# EAGLE design mbgw_teensy (EAGLE 8.1.0)
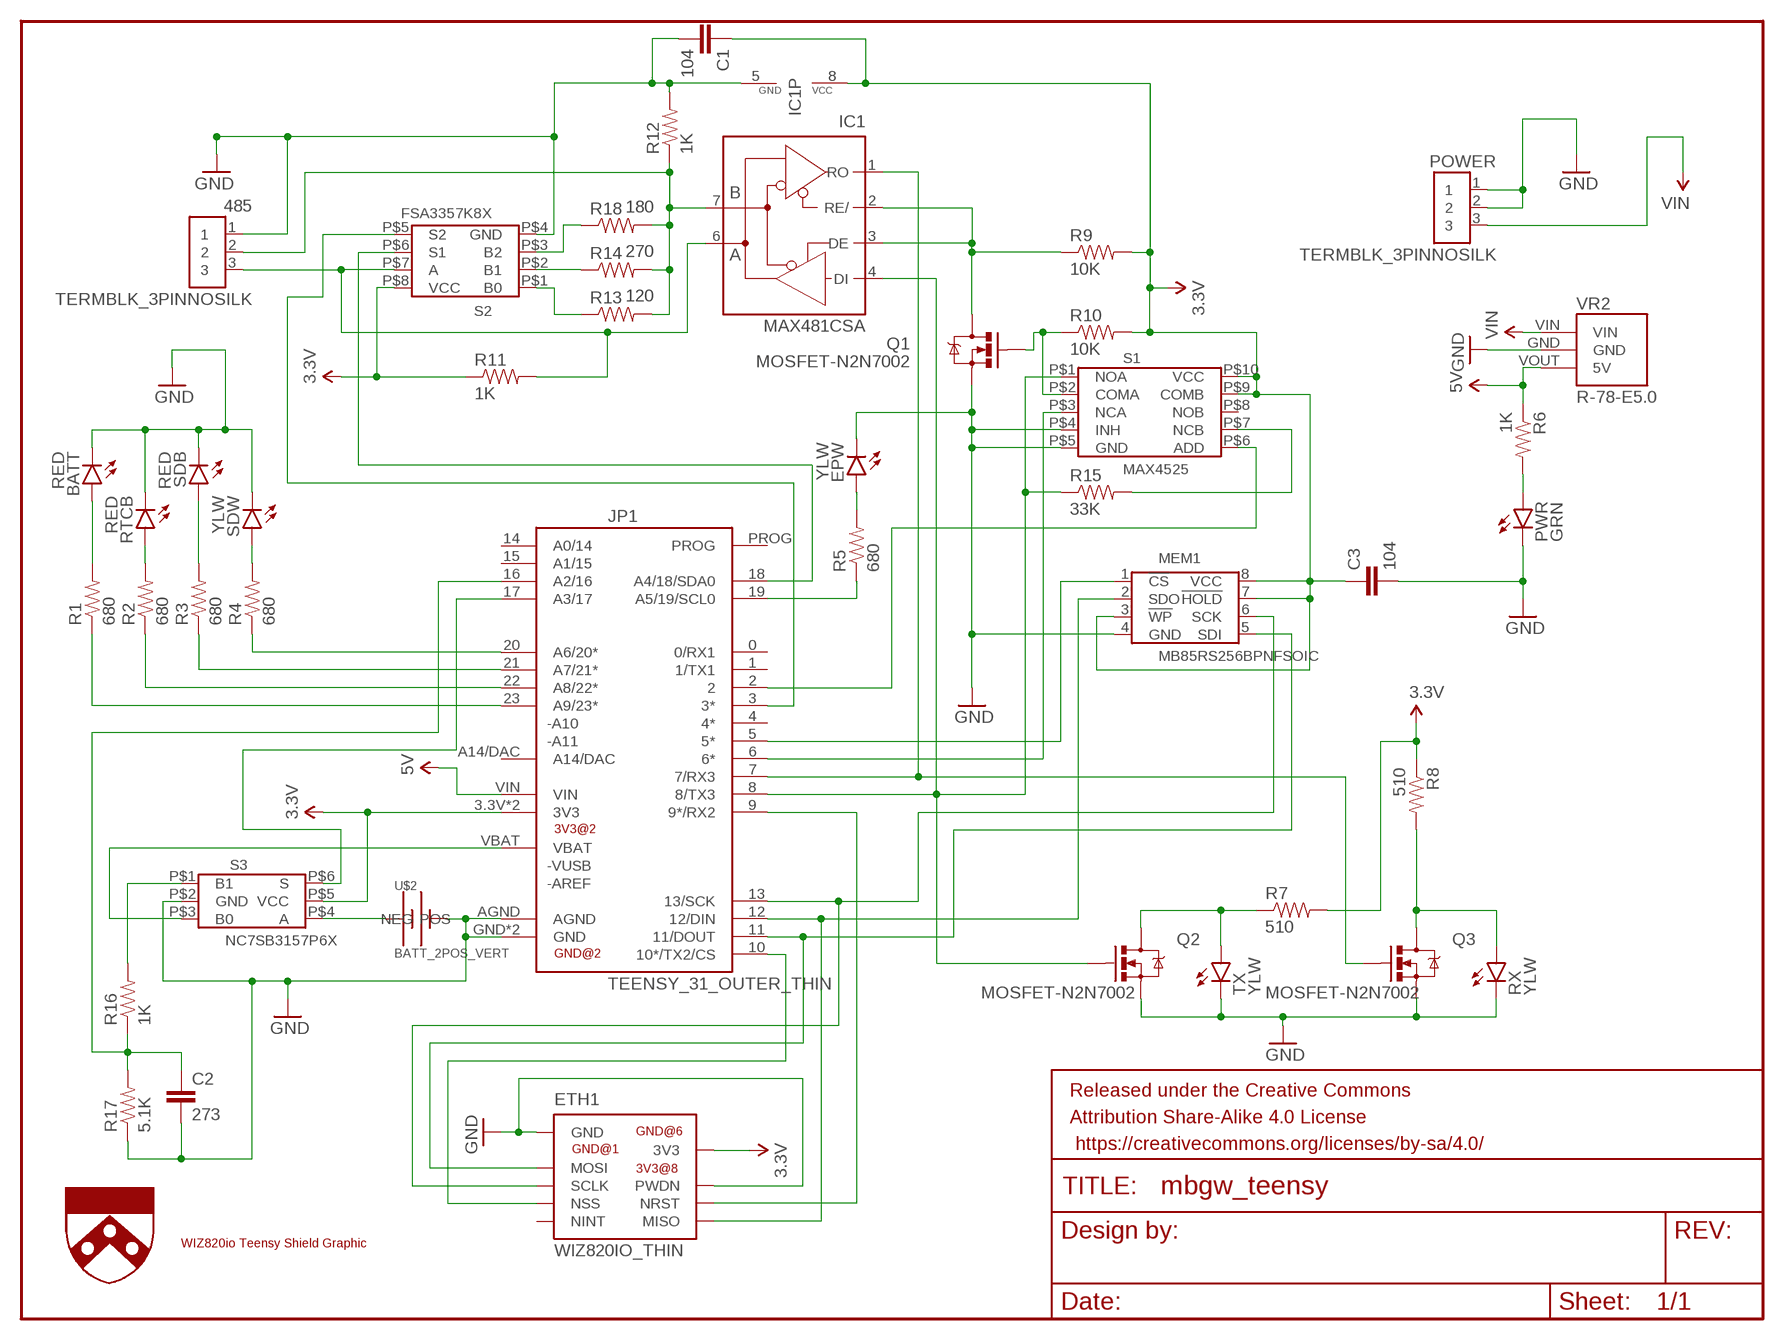
[diagram p0: schematic, sheet 1]

## Parts
485  TERMBLK_3PINNOSILK  [TERMBLK_3PIN_90_NOSILK]
BATT  RED  LED0603  [LED-0603]
C1  104  CAP0603-CAP  [0603-CAP]
C2  273  CAP0603-CAP  [0603-CAP]
C3  104  CAP0603-CAP  [0603-CAP]
EPW  YLW  LED0603  [LED-0603]
ETH1  WIZ820IO_THIN  [WIZ820IO_THIN]
FRAME1  FRAME-LETTERNO_PACKAGE  [DUMMY]
IC1  MAX481CSA  [SO08]
JP1  TEENSY_31_OUTER_THIN  [TEENSY-3.1_OUTER_THIN]
MEM1  MB85RS256BPNFSOIC  [SO08]
POWER  TERMBLK_3PINNOSILK  [TERMBLK_3PIN_90_NOSILK]
PWR  GRN  LED0603  [LED-0603]
Q1  MOSFET-N2N7002  [SOT23-3]
Q2  MOSFET-N2N7002  [SOT23-3]
Q3  MOSFET-N2N7002  [SOT23-3]
R1  680  RESISTOR0603  [0603-RES]
R2  680  RESISTOR0603  [0603-RES]
R3  680  RESISTOR0603  [0603-RES]
R4  680  RESISTOR0603  [0603-RES]
R5  680  RESISTOR0603  [0603-RES]
R6  1K  RESISTOR0603  [0603-RES]
R7  510  RESISTOR0603  [0603-RES]
R8  510  RESISTOR0603  [0603-RES]
R9  10K  RESISTOR0603  [0603-RES]
R10  10K  RESISTOR0603  [0603-RES]
R11  1K  RESISTOR0603  [0603-RES]
R12  1K  RESISTOR0603  [0603-RES]
R13  120  RESISTOR0603  [0603-RES]
R14  270  RESISTOR0603  [0603-RES]
R15  33K  RESISTOR0603  [0603-RES]
R16  1K  RESISTOR0603  [0603-RES]
R17  5.1K  RESISTOR0603  [0603-RES]
R18  180  RESISTOR0603  [0603-RES]
RTCB  RED  LED0603  [LED-0603]
RX  YLW  LED0603  [LED-0603]
S1  MAX4525  [3MM_10PIN]
S2  FSA3357K8X  [2.3MM_8PIN]
S3  NC7SB3157P6X  [1.25MM_6PIN]
SDB  RED  LED0603  [LED-0603]
SDW  YLW  LED0603  [LED-0603]
TX  YLW  LED0603  [LED-0603]
U$1  WIZ820_SHLD_OVRLY  [WIZ820_SHLD_OVERLAY]
U$2  BATT_2POS_VERT  [BATTCONN_20MM_VERT]
U$4  UPENN_SHIELD_.3_SILK  [UPENN_SHIELD_3_SILK]
VR2  R-78-E5.0  [R-78-EXX]

## Nets
3.3V: C1.1 C3.1 ETH1.3V3@7(3V3) ETH1.3V3@8(3V3) IC1.8(VCC) JP1.3.3V(3V3) JP1.3V(3V3) MEM1.3(!WP!) MEM1.7(!HOLD!) MEM1.8(VCC) R7.2 R8.1 R9.2 R10.2 R11.1 S1.P$9(COMB) S1.P$10(VCC) S2.P$8(VCC) S3.P$5(VCC)
5V: JP1.VIN R6.1 VR2.VOUT(5V)
GND: 485.1 BATT.C C1.2 C2.2 C3.2 EPW.C ETH1.GND@0(GND) ETH1.GND@1(GND) ETH1.GND@6(GND) ETH1.PWDN IC1.5(GND) JP1.AGND JP1.GND JP1.GND1(GND) MEM1.4(GND) POWER.1 POWER.2 PWR.C Q1.2(S) Q2.2(S) Q3.2(S) R12.2 R17.1 RTCB.C RX.C S1.P$4(INH) S1.P$5(GND) S2.P$4(GND) S3.P$2(GND) SDB.C SDW.C TX.C U$2.NEG VR2.GND
N$1: R15.2 S1.P$7(NCB)
N$2: JP1.6(6*) S1.P$3(NCA)
N$3: S3.P$4(A) U$2.POS@1(POS) U$2.POS@2(POS)
N$4: JP1.19(A5/19/SCL0) R5.1
N$5: ETH1.NSS JP1.10(10*/TX2/CS)
N$6: ETH1.MOSI JP1.11(11/DOUT) MEM1.5(SDI)
N$7: ETH1.MISO JP1.12(12/DIN) MEM1.2(SDO)
N$8: ETH1.SCLK JP1.13(13/SCK) MEM1.6(SCK)
N$9: JP1.23(A9/23*) R1.1
N$10: ETH1.NRST JP1.9(9*/RX2)
N$11: EPW.A R5.2
N$12: R13.1 S2.P$1(B0)
N$13: 485.2 IC1.7(B) R12.1 R13.2 R14.2 R18.2
N$14: PWR.A R6.2
N$15: JP1.18(A4/18/SDA0) S2.P$6(S1)
N$16: IC1.1(RO) JP1.7(7/RX3) Q3.1(G)
N$17: IC1.4(DI) JP1.8(8/TX3) Q2.1(G) R15.1 S1.P$1(NOA)
N$18: BATT.A R1.2
N$19: R3.2 SDB.A
N$20: R2.2 RTCB.A
N$21: R4.2 SDW.A
N$22: JP1.22(A8/22*) R2.1
N$23: JP1.21(A7/21*) R3.1
N$24: JP1.20(A6/20*) R4.1
N$25: 485.3 IC1.6(A) R11.2 S2.P$7(A)
N$26: Q1.1(G) R10.1 S1.P$2(COMA)
N$27: IC1.2(RE/) IC1.3(DE) Q1.3(D) R9.1
N$28: Q3.3(D) R8.2 RX.A
N$29: Q2.3(D) R7.1 TX.A
N$30: R14.1 S2.P$2(B1)
N$31: JP1.3(3*) S2.P$5(S2)
N$32: JP1.2 S1.P$6(ADD)
N$33: JP1.VBAT S3.P$3(B0)
N$34: R18.1 S2.P$3(B2)
N$35: C2.1 JP1.16(A2/16) R16.1 R17.2
N$36: JP1.5(5*) MEM1.1(!CS!)
N$37: R16.2 S3.P$1(B1)
N$38: JP1.17(A3/17) S3.P$6(S)
VIN: POWER.3 VR2.VIN
Unconnected: ETH1.NINT JP1.0(0/RX1) JP1.1(1/TX1) JP1.4(4*) JP1.14(A0/14) JP1.15(A1/15) JP1.A14/DAC JP1.PROG S1.P$8(NOB)

## Library data of the parts
485 POWER = UPenn:TERMBLK_3PIN
BATT EPW PWR RTCB RX SDB SDW TX = SparkFun-LED:LED: LEDs Standard schematic elements and footprints for 5mm, 3mm, 1206, and 0603 sized LEDs. 5mm - Spark Fun Electronics SKU : COM-00529 (and others)
C1-C3 = SparkFun-Capacitors:CAP: Capacitor Standard 0603 ceramic capacitor, and 0.1" leaded capacitor.
ETH1 = UPenn:WIZ820IO
FRAME1 = SparkFun-Aesthetics:FRAME-LETTER: Schematic Frame Standard 8.5x11 US Letter frame; DESIGNER: Nobody; VERSION: v01
IC1 = maxim:MAX481CSA: RS485 TRANSEIVER; MF: MAXIM; MPN: MAX481CSA; OC_FARNELL: unknown; OC_NEWARK: 90C3817
JP1 = UPenn:TEENSY_31_OUTER
MEM1 = UPenn:MB85RS256BPNF
Q1-Q3 = UPenn:MOSFET-N
R1-R18 = SparkFun-Resistors:RESISTOR: Resistor Basic schematic elements and footprints for 0603, 1206, and PTH resistors.
S1 = UPenn:MAX4525: DPDT analog switch
S2 = UPenn:FSA3357K8X: SPTT analog switch
S3 = UPenn:NC7SB3157P6X: SPDT analog switch, B0 is NC
U$1 = UPenn:WIZ820_SHLD_OVRLY
U$2 = UPenn:BATT_2POS
U$4 = UPenn:UPENN_SHIELD
VR2 = UPenn:R-78-E5.0

## Board
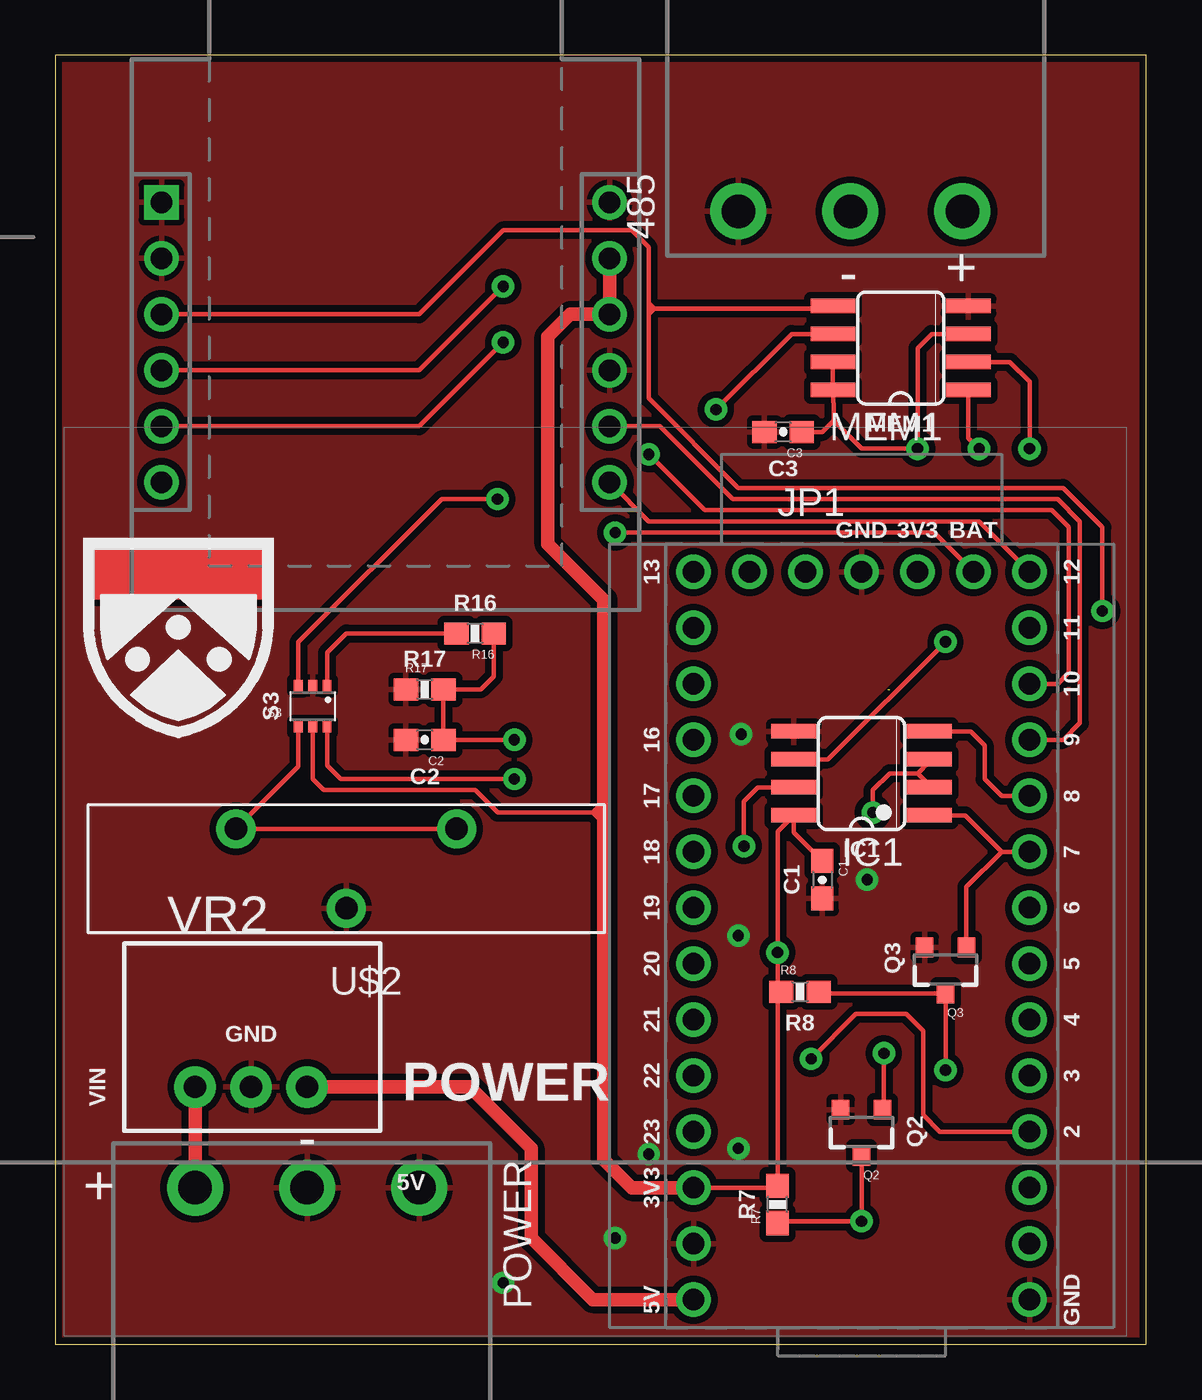
[diagram p1: board, top side]
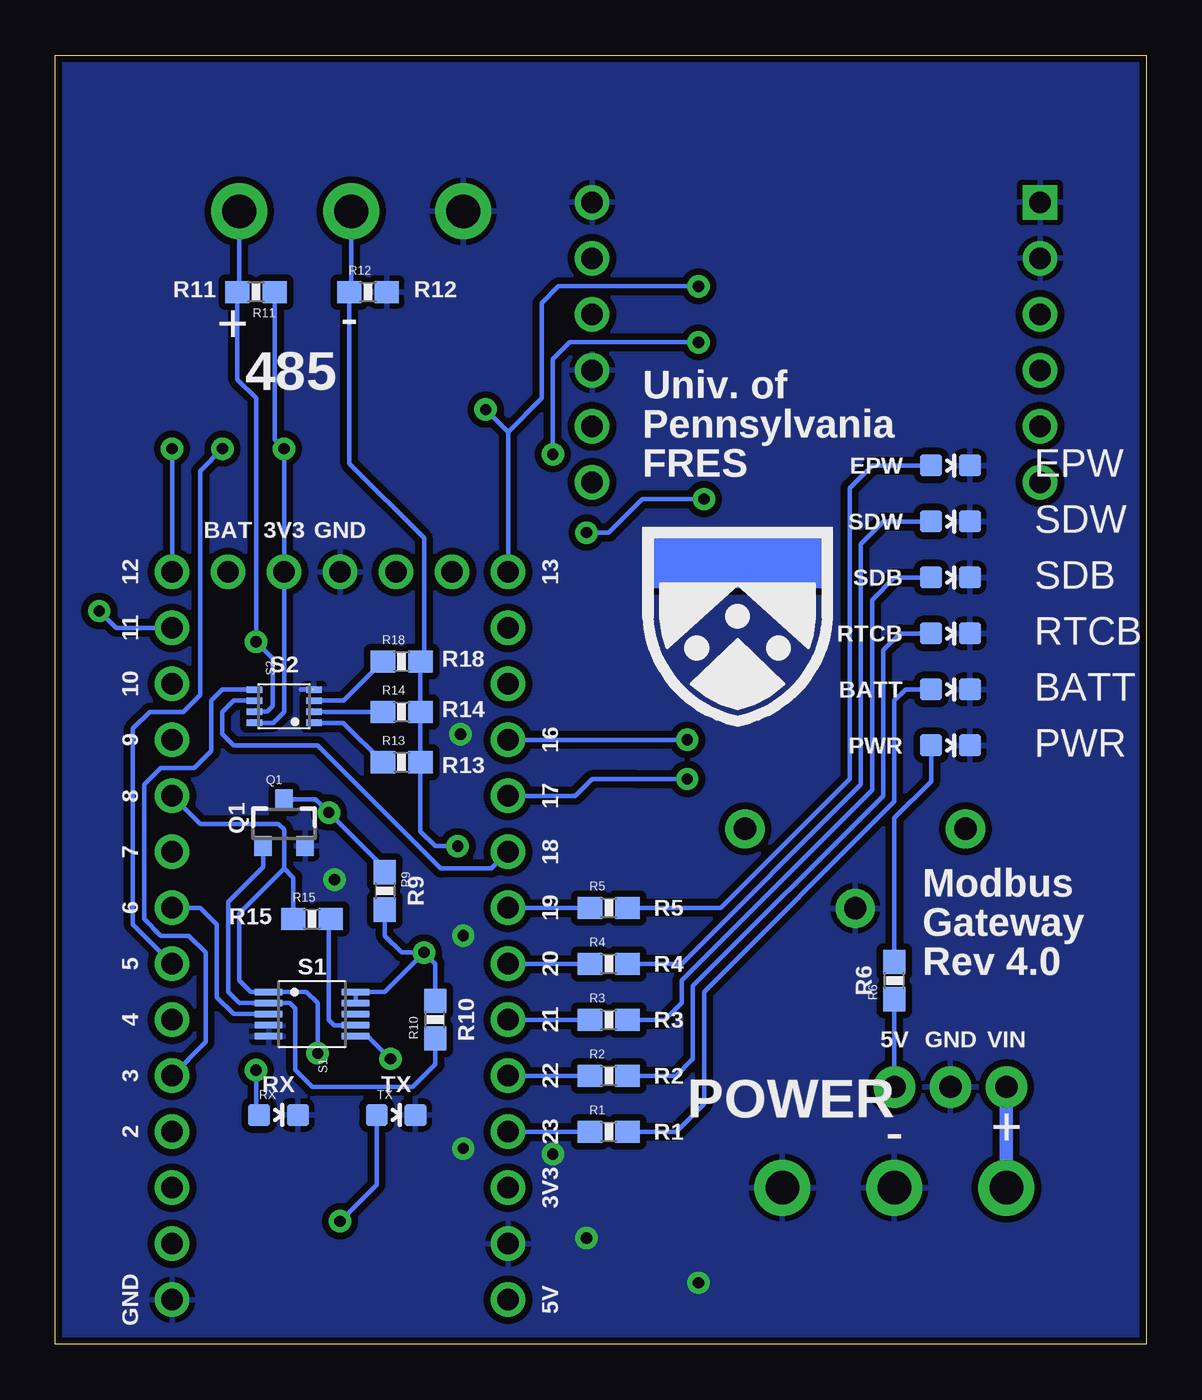
[diagram p2: board, bottom side, seen from below]

Size 49.5 x 58.5 mm. Coordinates in mm from the lower left corner, seen from the top.
Outline: 0,0 49.5,0 49.5,58.5 0,58.5 0,0
Copper layers (1*16): Top 0.035mm / dielectric 1.5mm / Bottom 0.035mm
Design rules "SparkFun": minimum track width 8mil, minimum drill 20mil, track to track 8mil, track to pad 8mil, pad to pad 8mil, via to via 8mil, smd to smd 8mil, copper to edge 8mil, drill to drill 8mil, minimum pad ring 12mil, minimum via ring 10mil, stop-mask expansion 4mil, vias tented up to drill 20mil, thermal gap 10mil

### Footprints (pad centres in the part's own frame; a part is rotated, then mirrored left to right if it is on the bottom)
TERMBLK_3PIN_90_NOSILK = drill 1.524 pad 2.54: 1 -5.08,0; 2 0,0; 3 5.08,0
LED-0603 = smd 1 x 1: A 0,-0.877; C 0,0.877
0603-CAP = smd 1.1 x 1: 1 -0.85,0; 2 0.85,0
WIZ820IO_THIN = drill 0.965: 3V3@7 10.16,3.81; 3V3@8 10.16,1.27; GND@1 -10.16,3.81; GND@6 10.16,6.35; MISO 10.16,-6.35; MOSI -10.16,1.27; NINT -10.16,-6.35; NRST 10.16,-3.81; NSS -10.16,-3.81; PWDN 10.16,-1.27; SCLK -10.16,-1.27 | drill 0.965 square: GND@0 -10.16,6.35
SO08 = smd 0.66 x 2.032: 1 -1.905,-3.073; 2 -0.635,-3.073; 3 0.635,-3.073; 4 1.905,-3.073; 5 1.905,3.073; 6 0.635,3.073; 7 -0.635,3.073; 8 -1.905,3.073
TEENSY-3.1_OUTER_THIN = drill 0.965: 0 16.51,3.81; 1 16.51,6.35; 2 16.51,8.89; 3 16.51,11.43; 3.3V 11.43,34.29; 3V 1.27,6.35; 4 16.51,13.97; 5 16.51,16.51; 6 16.51,19.05; 7 16.51,21.59; 8 16.51,24.13; 9 16.51,26.67; 10 16.51,29.21; 11 16.51,31.75; 12 16.51,34.29; 13 1.27,34.29; 14 1.27,31.75; 15 1.27,29.21; 16 1.27,26.67; 17 1.27,24.13; 18 1.27,21.59; 19 1.27,19.05; 20 1.27,16.51; 21 1.27,13.97; 22 1.27,11.43; 23 1.27,8.89; A14/DAC 3.81,34.29; AGND 1.27,3.81; GND 8.89,34.29; GND1 16.51,1.27; PROG 6.35,34.29; VBAT 13.97,34.29; VIN 1.27,1.27
SOT23-3 = smd 0.8 x 0.9: 1 -0.95,-1; 2 0.95,-1; 3 0,1.1
0603-RES = smd 1.1 x 1: 1 -0.85,0; 2 0.85,0
3MM_10PIN = smd 0.3 x 1.25: P$1 -1,-1.975; P$2 -0.5,-1.975; P$3 0,-1.975; P$4 0.5,-1.975; P$5 1,-1.975; P$6 1,1.975; P$7 0.5,1.975; P$8 0,1.975; P$9 -0.5,1.975; P$10 -1,1.975
2.3MM_8PIN = smd 0.3 x 0.7: P$1 -0.75,-1.35; P$2 -0.25,-1.35; P$3 0.25,-1.35; P$4 0.75,-1.35; P$5 0.75,1.35; P$6 0.25,1.35; P$7 -0.25,1.35; P$8 -0.75,1.35
1.25MM_6PIN = smd 0.4 x 0.5: P$1 -0.65,-0.95; P$2 0,-0.95; P$3 0.65,-0.95; P$4 0.65,0.95; P$5 0,0.95; P$6 -0.65,0.95
BATTCONN_20MM_VERT = drill 1.016 pad 1.778: NEG 0,1.803; POS@1 -5.004,-1.803; POS@2 5.004,-1.803
R-78-EXX = drill 1.016 pad 1.88: GND 0,0; VIN -2.54,0; VOUT 2.54,0

### Placement (x,y rotation side)
485  36.07,51.41 0 top
BATT  8.89,29.72 270 bottom
C1  34.8,21.08 270 top
C2  16.76,27.43 180 top
C3  33.02,41.4 180 top
EPW  8.89,39.88 270 bottom
ETH1  14.99,45.47 0 top
FRAME1  0,46.99 0 top
IC1  36.58,25.91 90 top
JP1  27.69,0.76 0 top
MEM1  38.35,45.21 90 top
POWER  11.43,7.11 180 top
PWR  8.89,27.18 270 bottom
Q1  39.12,23.62 0 bottom
Q2  36.58,9.65 180 top
Q3  40.39,17.02 180 top
R1  24.38,9.65 0 bottom
R2  24.38,12.19 0 bottom
R3  24.38,14.73 0 bottom
R4  24.38,17.27 0 bottom
R5  24.38,19.81 0 bottom
R6  11.43,16.51 90 bottom
R7  32.77,6.35 90 top
R8  33.78,16 0 top
R9  34.54,20.57 270 bottom
R10  32.26,14.73 90 bottom
R11  40.39,47.75 180 bottom
R12  35.31,47.75 0 bottom
R13  33.78,26.42 0 bottom
R14  33.78,28.7 0 bottom
R15  37.85,19.3 0 bottom
R16  19.05,32.26 180 top
R17  16.76,29.72 0 top
R18  33.78,30.99 0 bottom
RTCB  8.89,32.26 270 bottom
RX  39.37,10.41 270 bottom
S1  37.85,14.99 270 bottom
S2  39.12,28.96 90 bottom
S3  11.68,28.96 180 top
SDB  8.89,34.8 270 bottom
SDW  8.89,37.34 270 bottom
TX  34.04,10.41 270 bottom
U$1  27.69,0.76 0 top
U$2  13.21,21.59 180 top
U$3  UPENN_SHIELD_.3_SILK  [UPENN_SHIELD_3_SILK]  1.78,36.07 0 top
U$4  22.35,36.58 0 bottom
VR2  8.89,11.68 0 top

### Tracks (layer width: path | path; a pad name or v marks a point on that pad's centre or on a via)
3.3V  (via drill 0.51)
  Top 0.203: JP1.3V 32.68,7.11 R7.2 32.77,15.84 R8.1 32.77,16.17 v32.77,17.78 32.77,23.27 IC1.8 33.5,23.23 C1.1 | 24.38,24.13 24.64,24.13 24.89,23.88 | 24.38,24.13 24.64,23.88 | 24.38,24.13 24.64,24.38 | S3.P$5 11.68,25.65 12.19,25.15 19.05,25.15 20.07,24.13 24.38,24.13 | 35.31,41.91 36.58,40.64 v39.12,40.64 39.12,45.21 39.75,45.85 MEM1.3 | 35.31,41.91 35.31,42.52 MEM1.8 MEM1.7 | C3.1 34.8,41.4 35.31,41.91
  Top 0.61: ETH1.3V3@7 ETH1.3V3@8 23.37,46.74 22.35,45.72 22.35,36.32 24.89,33.78 24.89,23.88 24.89,8.38 26.16,7.11 JP1.3V
  Bottom 0.203: v32.77,17.78 32.26,17.27 R10.2 | 34.54,19.56 R9.2 34.54,18.54 33.78,17.78 v32.77,17.78 | S1.P$9 S1.P$10 34.56,15.99 v32.77,17.78 | R11.1 39.54,41.06 v39.12,40.64 JP1.3.3V 39.12,28.7 39.61,28.21 S2.P$8
5V
  Top 0.61: VR2.VOUT 18.8,11.68 21.59,8.89 21.59,4.83 24.38,2.03 JP1.VIN
  Bottom 0.203: VR2.VOUT R6.1
GND  (via drill 0.51)  (1 unrouted)
  Bottom 0.203: 37.85,29.72 38.35,29.72
  other vias: 30.99,18.54 30.99,8.89 25.4,4.83 31.11,27.69 36.83,21.08 20.32,2.79 26.92,8.64
  pour Top (isolate 0.305): 0,0 0,58.5 49.5,58.5 49.5,0
  pour Bottom (isolate 0.305): 0,0 0,58.5 49.5,58.5 49.5,0
N$1
  Bottom 0.203: S1.P$7 36.84,14.49 37.08,14.73 37.08,19.22 R15.2
N$2
  Bottom 0.203: S1.P$3 41.4,14.99 42.16,15.75 42.16,19.05 42.93,19.81 JP1.6
N$3
  Top 0.203: U$2.POS@1 U$2.POS@2 11.03,26.22 S3.P$4
N$4
  Bottom 0.203: JP1.19 R5.1
N$5  (via drill 0.51)
  Top 0.203: JP1.10 45.47,29.97 45.97,30.48 45.97,37.08 45.21,37.85 29.46,37.85 v26.92,40.39 | v20.32,45.47 16.51,41.66 ETH1.NSS
  Bottom 0.203: v26.92,40.39 26.92,44.7 26.16,45.47 v20.32,45.47
N$6  (via drill 0.51)
  Top 0.203: v47.5,33.27 47.5,37.08 45.72,38.86 30.99,38.86 26.92,42.93 26.92,46.74 | 26.92,46.99 26.92,46.74 | 26.92,46.99 26.92,47.24 | 26.92,47.24 26.92,49.78 26.16,50.55 20.32,50.55 16.51,46.74 ETH1.MOSI | MEM1.5 35.15,46.99 27.18,46.99 | 27.18,46.99 26.92,46.99 | 26.92,46.74 27.18,46.99 | 27.18,46.99 26.92,47.24
  Bottom 0.203: JP1.11 46.74,32.51 v47.5,33.27
N$7  (via drill 0.51)
  Top 0.203: JP1.12 41.91,37.34 26.92,37.34 ETH1.MISO | v44.2,40.64 44.2,43.69 43.31,44.58 MEM1.2
  Bottom 0.203: JP1.12 v44.2,40.64
N$8  (via drill 0.51)
  Top 0.203: MEM1.6 33.4,45.85 v29.97,42.42 | v20.32,48.01 16.51,44.2 ETH1.SCLK
  Bottom 0.203: JP1.13 28.96,41.4 | 28.96,41.4 27.43,42.93 27.43,47.24 26.67,48.01 v20.32,48.01 | 28.96,41.4 v29.97,42.42
N$9
  Bottom 0.203: JP1.23 R1.1
N$10
  Top 0.203: JP1.9 45.72,27.43 46.48,28.19 46.48,37.34 45.47,38.35 30.73,38.35 27.43,41.66 ETH1.NRST
N$11
  Bottom 0.203: EPW.A 12.45,39.88 13.46,38.86 13.46,25.65 19.3,19.81 R5.2
N$12
  Bottom 0.203: 37.25,28.19 S2.P$1 36.42,28.21 R13.1
N$13  (via drill 0.51)
  Top 0.203: IC1.7 31.88,25.27 31.24,24.64 v31.24,22.61
  Bottom 0.203: v31.24,22.61 32.26,22.61 32.93,23.28 R13.2 R14.2 R18.2 32.77,31.15 32.77,36.58 36.16,39.97 R12.1 36.07,47.84 485.2
N$14
  Bottom 0.203: PWR.A 9.77,25.54 11.43,23.88 R6.2
N$15
  Bottom 0.203: JP1.18 29.72,21.59 32,21.59 37.59,27.18 41.4,27.18 41.91,27.69 41.91,28.7 41.4,29.21 S2.P$6
N$16
  Top 0.203: JP1.7 42.93,22.35 | 42.93,22.35 41.27,24 IC1.1 | 42.93,22.35 41.34,20.76 Q3.1
N$17  (via drill 0.51)
  Top 0.203: JP1.8 42.93,24.89 42.16,25.65 42.16,27.18 41.53,27.81 IC1.4 | v37.59,13.21 37.59,10.72 Q2.1
  Bottom 0.203: 39.12,21.59 39.12,23.37 39.37,23.62 42.93,23.62 JP1.8 | R15.1 38.7,21.17 39.12,21.59 | v37.59,13.21 37.59,15.49 38.1,16 39.8,16 S1.P$1 40.62,15.99 41.15,16.51 41.15,19.56 39.12,21.59
N$18
  Bottom 0.203: BATT.A 10.92,29.72 11.43,29.21 11.43,24.64 20.07,16 20.07,10.92 21.34,9.65 R1.2
N$19
  Bottom 0.203: SDB.A 11.43,34.8 12.45,33.78 12.45,25.15 21.08,16.51 21.08,15.49 21.84,14.73 R3.2
N$20
  Bottom 0.203: RTCB.A 11.18,32.26 11.94,31.5 11.94,24.89 20.57,16.26 20.57,12.95 21.34,12.19 R2.2
N$21
  Bottom 0.203: SDW.A 11.94,37.34 12.95,36.32 12.95,25.4 21.08,17.27 R4.2
N$22
  Bottom 0.203: JP1.22 R2.1
N$23
  Bottom 0.203: JP1.21 R3.1
N$24
  Bottom 0.203: JP1.20 R4.1
N$25  (via drill 0.51)
  Top 0.203: IC1.6 35.05,26.54 v40.39,31.88
  Bottom 0.203: S2.P$7 39.87,28.71 39.62,28.96 39.62,31.11 v40.39,31.88 40.39,42.93 41.24,43.78 R11.2 41.15,47.84 485.3
N$26
  Bottom 0.203: Q1.1 40.07,21.66 41.66,20.07 41.66,16 41.15,15.49 S1.P$2 38.86,15.49 38.61,15.24 38.61,12.45 37.85,11.68 33.27,11.68 32.26,12.7 R10.1
N$27  (via drill 0.51)
  Top 0.203: IC1.3 39.65,26.44 39.12,25.91 | 39.12,25.91 37.85,25.91 37.08,25.15 v37.08,24.13 | IC1.2 39.65,25.38 39.12,25.91
  Bottom 0.203: 34.71,21.59 R9.1 34.54,21.59 v37.08,24.13 37.59,24.64 | 37.68,24.72 37.59,24.64 | 37.59,24.64 37.68,24.72 | 37.68,24.72 Q1.3
N$28  (via drill 0.51)
  Top 0.203: v40.39,12.45 Q3.3 34.72,15.92 R8.2
  Bottom 0.203: v40.39,12.45 40.39,10.04 RX.A
N$29  (via drill 0.51)
  Top 0.203: Q2.3 v36.58,5.59 32.85,5.59 R7.1
  Bottom 0.203: v36.58,5.59 34.91,7.25 TX.A
N$30
  Bottom 0.203: R14.1 37.25,28.7 S2.P$2
N$31
  Bottom 0.203: JP1.3 42.67,13.72 42.67,17.78 43.43,18.54 44.7,18.54 45.47,19.3 45.47,25.4 44.7,26.16 43.18,26.16 42.42,26.92 42.42,29.21 41.91,29.72 S2.P$5
N$32  (via drill 0.51)
  Top 0.203: v34.29,12.95 36.32,14.99 38.61,14.99 39.37,14.22 39.37,10.41 40.13,9.65 JP1.2
  Bottom 0.203: 35.81,13.93 S1.P$6 35.32,13.99 v34.29,12.95
N$33  (via drill 0.51)
  Top 0.203: JP1.VBAT 39.88,36.83 v25.4,36.83 | v20.07,38.35 17.53,38.35 11.03,31.86 S3.P$3
  Bottom 0.203: v25.4,36.83 24.38,36.83 22.86,38.35 v20.07,38.35
N$34
  Bottom 0.203: S2.P$3 36.41,29.21 R18.1
N$35  (via drill 0.51)
  Top 0.203: v20.83,27.43 C2.1 R17.2 19.3,29.72 19.9,30.31 R16.1
  Bottom 0.203: v20.83,27.43 22.86,27.43 | 22.86,27.43 23.37,27.43 | 22.86,27.43 JP1.16
N$36  (via drill 0.51)
  Top 0.203: v41.91,40.64 41.43,41.12 MEM1.1
  Bottom 0.203: JP1.5 45.97,19.05 45.97,27.94 45.21,28.7 43.69,28.7 42.93,29.46 42.93,39.62 v41.91,40.64
N$37
  Top 0.203: S3.P$1 12.33,31.38 13.21,32.26 R16.2
N$38  (via drill 0.51)
  Top 0.203: S3.P$6 12.33,26.27 12.95,25.65 v20.83,25.65
  Bottom 0.203: v20.83,25.65 22.86,25.65 23.11,25.65 25.15,25.65 25.91,24.89 JP1.17
VIN
  Top 0.61: POWER.3 VR2.VIN
  Bottom 0.61: POWER.3 VR2.VIN

### Text on the board
tPlace: - | + | MEM1 | C3 | GND | 3V3 | BAT | 13 | 12 | R16 | 11 | R17 | 10 | S3 | 16 | 9 | C2 | 17 | 8 | 18 | IC1 | 7 | C1 | 19 | 6 | Q3 | 20 | 5 | 21 | 4 | GND | R8 | VIN | POWER | 22 | 3 | 23 | Q2 | 2 | - | 5V | 3V3 | + | R7 | 5V | GND
bPlace: R12 | R11 | - | + | 485 | Univ. of | Pennsylvania | EPW | FRES | SDW | GND | 3V3 | BAT | SDB | 13 | 12 | 11 | RTCB | R18 | BATT | S2 | 10 | R14 | PWR | 16 | R13 | 9 | 17 | 8 | Q1 | 18 | 7 | R9 | Modbus | R5 | 19 | 6 | Gateway | R15 | S1 | Rev 4.0 | R6 | R4 | 20 | 5 | R3 | 21 | R10 | 4 | VIN | GND | 5V | R2 | 22 | 3 | POWER | TX | RX | + | - | R1 | 23 | 2 | 3V3 | 5V | GND